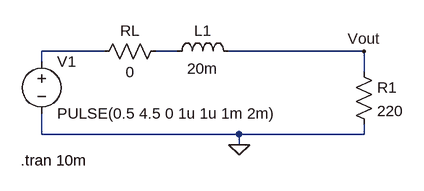
[diagram p0: schematic rl_filt_ltspice.asc]
rl_filt_ltspice.asc, the LTspice schematic file:
Version 4
SHEET 1 880 680
WIRE -32 80 -128 80
WIRE 80 80 48 80
WIRE 368 80 160 80
WIRE -128 96 -128 80
WIRE 368 112 368 80
WIRE -128 208 -128 176
WIRE 176 208 -128 208
WIRE 368 208 368 192
WIRE 368 208 176 208
WIRE 176 224 176 208
FLAG 176 224 0
FLAG 368 80 Vout
SYMBOL res 352 96 R0
SYMATTR InstName R1
SYMATTR Value 220
SYMBOL voltage -128 80 R0
WINDOW 123 0 0 Left 0
WINDOW 39 0 0 Left 0
SYMATTR InstName V1
SYMATTR Value PULSE(0.5 4.5 0 1u 1u 1m 2m)
SYMBOL ind 64 96 R270
WINDOW 0 32 56 VTop 2
WINDOW 3 5 56 VBottom 2
SYMATTR InstName L1
SYMATTR Value 20m
SYMBOL res 64 64 R90
WINDOW 0 0 56 VBottom 2
WINDOW 3 32 56 VTop 2
SYMATTR InstName RL
SYMATTR Value 0
TEXT -160 248 Left 2 !.tran 10m

The netlist it stands for:
* rl_filt_ltspice.asc
R1 Vout 0 220
V1 N001 0 PULSE(0.5 4.5 0 1u 1u 1m 2m)
L1 N002 Vout 20m
RL N002 N001 0
.tran 10m
.backanno
.end